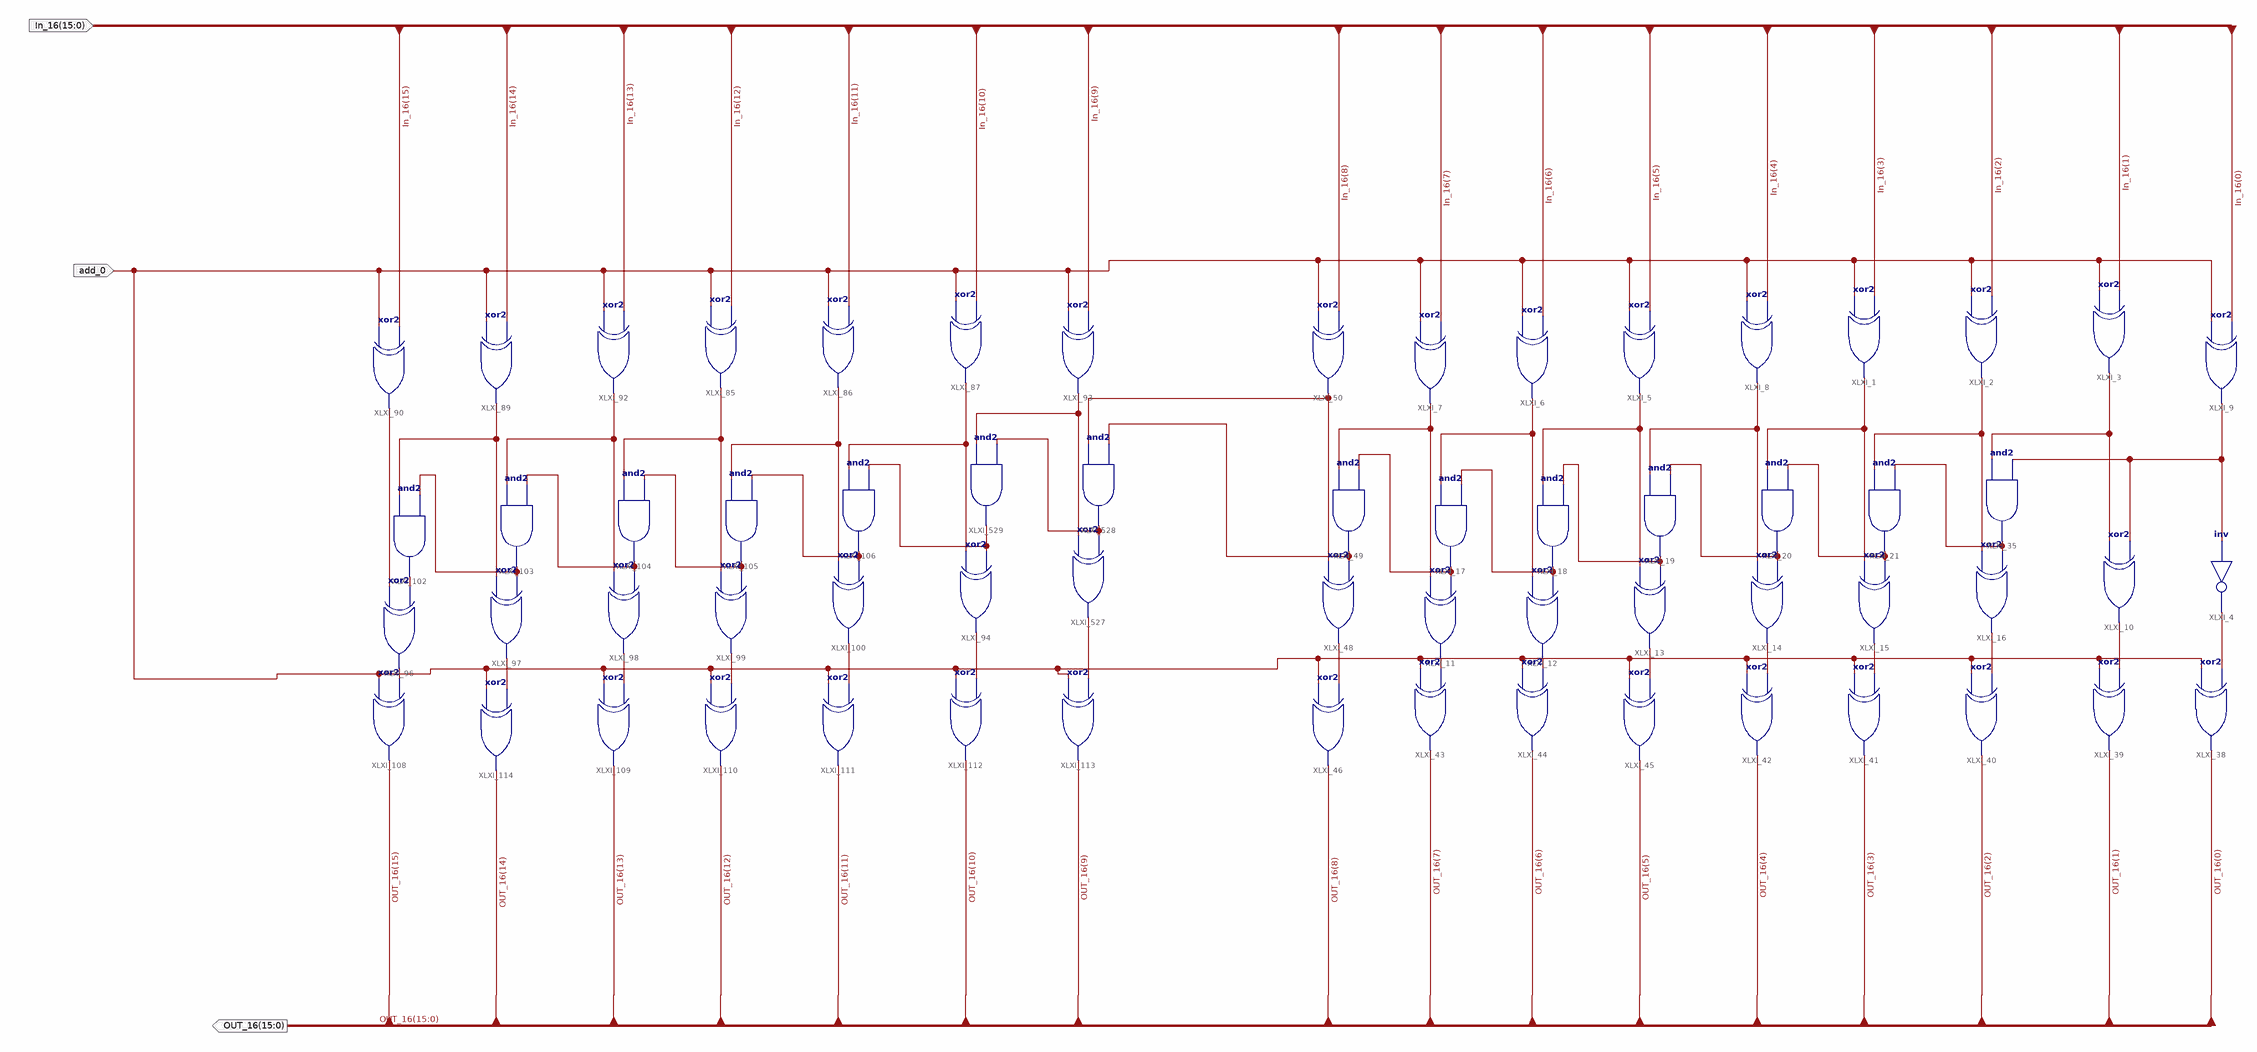
[diagram p0: schematic sheet 1]
// Xilinx ISE schematic Incrementer_Decrementer_16.sch (spartan3e) as structural Verilog: 62 symbols, 3 ports
module Incrementer_Decrementer_16 (
  input  add_0,
  input  [15:0] In_16,
  output [15:0] OUT_16
);

  wire XLXN_1, XLXN_2, XLXN_3, XLXN_4, XLXN_5, XLXN_46, XLXN_47, XLXN_48, XLXN_52, XLXN_55, XLXN_57, XLXN_59,
       XLXN_62, XLXN_63, XLXN_64, XLXN_65, XLXN_66, XLXN_67, XLXN_68, XLXN_69, XLXN_70, XLXN_71, XLXN_73,
       XLXN_74, XLXN_75, XLXN_120, XLXN_121, XLXN_122, XLXN_123, XLXN_126, XLXN_127, XLXN_129, XLXN_130,
       XLXN_131, XLXN_133, XLXN_134, XLXN_135, XLXN_136, XLXN_137, XLXN_140, XLXN_971, XLXN_976, XLXN_982,
       XLXN_989, XLXN_1008, XLXN_1009;

  xor XLXI_1 (XLXN_2, add_0, In_16[3]);
  xor XLXI_2 (XLXN_3, add_0, In_16[2]);
  xor XLXI_3 (XLXN_4, add_0, In_16[1]);
  not XLXI_4 (XLXN_63, XLXN_52);
  xor XLXI_5 (XLXN_1, add_0, In_16[5]);
  xor XLXI_6 (XLXN_62, add_0, In_16[6]);
  xor XLXI_7 (XLXN_5, add_0, In_16[7]);
  xor XLXI_8 (XLXN_59, add_0, In_16[4]);
  xor XLXI_9 (XLXN_52, add_0, In_16[0]);
  xor XLXI_10 (XLXN_64, XLXN_4, XLXN_52);
  xor XLXI_11 (XLXN_68, XLXN_5, XLXN_75);
  xor XLXI_12 (XLXN_69, XLXN_62, XLXN_46);
  xor XLXI_13 (XLXN_70, XLXN_1, XLXN_47);
  xor XLXI_14 (XLXN_67, XLXN_59, XLXN_48);
  xor XLXI_15 (XLXN_66, XLXN_2, XLXN_57);
  xor XLXI_16 (XLXN_65, XLXN_3, XLXN_55);
  and XLXI_17 (XLXN_75, XLXN_62, XLXN_46);
  and XLXI_18 (XLXN_46, XLXN_1, XLXN_47);
  and XLXI_19 (XLXN_47, XLXN_59, XLXN_48);
  and XLXI_20 (XLXN_48, XLXN_2, XLXN_57);
  and XLXI_21 (XLXN_57, XLXN_3, XLXN_55);
  and XLXI_35 (XLXN_55, XLXN_4, XLXN_52);
  xor XLXI_43 (OUT_16[7], add_0, XLXN_68);
  xor XLXI_44 (OUT_16[6], add_0, XLXN_69);
  xor XLXI_42 (OUT_16[4], add_0, XLXN_67);
  xor XLXI_41 (OUT_16[3], add_0, XLXN_66);
  xor XLXI_40 (OUT_16[2], add_0, XLXN_65);
  xor XLXI_39 (OUT_16[1], add_0, XLXN_64);
  xor XLXI_38 (OUT_16[0], add_0, XLXN_63);
  xor XLXI_45 (OUT_16[5], add_0, XLXN_70);
  xor XLXI_46 (OUT_16[8], add_0, XLXN_71);
  xor XLXI_48 (XLXN_71, XLXN_74, XLXN_73);
  and XLXI_49 (XLXN_73, XLXN_5, XLXN_75);
  xor XLXI_50 (XLXN_74, add_0, In_16[8]);
  xor XLXI_114 (OUT_16[14], add_0, XLXN_140);
  xor XLXI_113 (OUT_16[9], add_0, XLXN_133);
  xor XLXI_112 (OUT_16[10], add_0, XLXN_134);
  xor XLXI_111 (OUT_16[11], add_0, XLXN_135);
  xor XLXI_110 (OUT_16[12], add_0, XLXN_136);
  xor XLXI_109 (OUT_16[13], add_0, XLXN_137);
  xor XLXI_108 (OUT_16[15], add_0, XLXN_971);
  and XLXI_106 (XLXN_129, XLXN_123, XLXN_982);
  and XLXI_105 (XLXN_130, XLXN_122, XLXN_129);
  and XLXI_104 (XLXN_127, XLXN_121, XLXN_130);
  and XLXI_103 (XLXN_126, XLXN_131, XLXN_127);
  and XLXI_102 (XLXN_1008, XLXN_120, XLXN_126);
  xor XLXI_100 (XLXN_135, XLXN_122, XLXN_129);
  xor XLXI_99 (XLXN_136, XLXN_121, XLXN_130);
  xor XLXI_98 (XLXN_137, XLXN_131, XLXN_127);
  xor XLXI_97 (XLXN_140, XLXN_120, XLXN_126);
  xor XLXI_96 (XLXN_971, XLXN_1009, XLXN_1008);
  xor XLXI_94 (XLXN_134, XLXN_123, XLXN_982);
  xor XLXI_93 (XLXN_976, add_0, In_16[9]);
  xor XLXI_92 (XLXN_131, add_0, In_16[13]);
  xor XLXI_90 (XLXN_1009, add_0, In_16[15]);
  xor XLXI_89 (XLXN_120, add_0, In_16[14]);
  xor XLXI_87 (XLXN_123, add_0, In_16[10]);
  xor XLXI_86 (XLXN_122, add_0, In_16[11]);
  xor XLXI_85 (XLXN_121, add_0, In_16[12]);
  xor XLXI_527 (XLXN_133, XLXN_976, XLXN_989);
  and XLXI_528 (XLXN_989, XLXN_74, XLXN_73);
  and XLXI_529 (XLXN_982, XLXN_976, XLXN_989);
endmodule
